# EAGLE design RH037.2 (EAGLE 7.1.0)
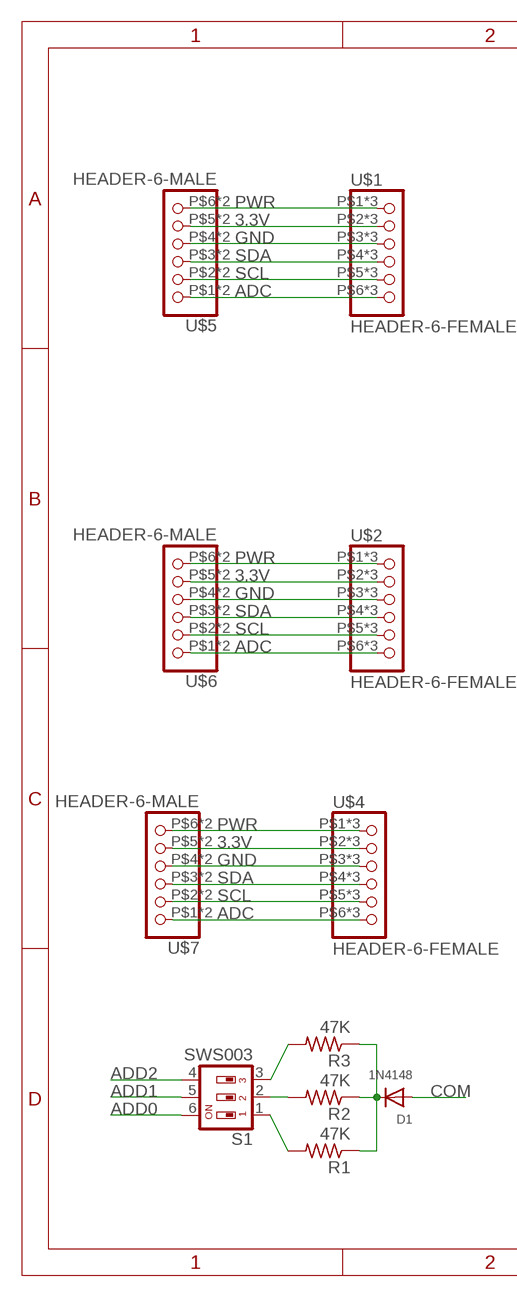
[diagram p0: schematic, sheet 1, part 1 of 2]
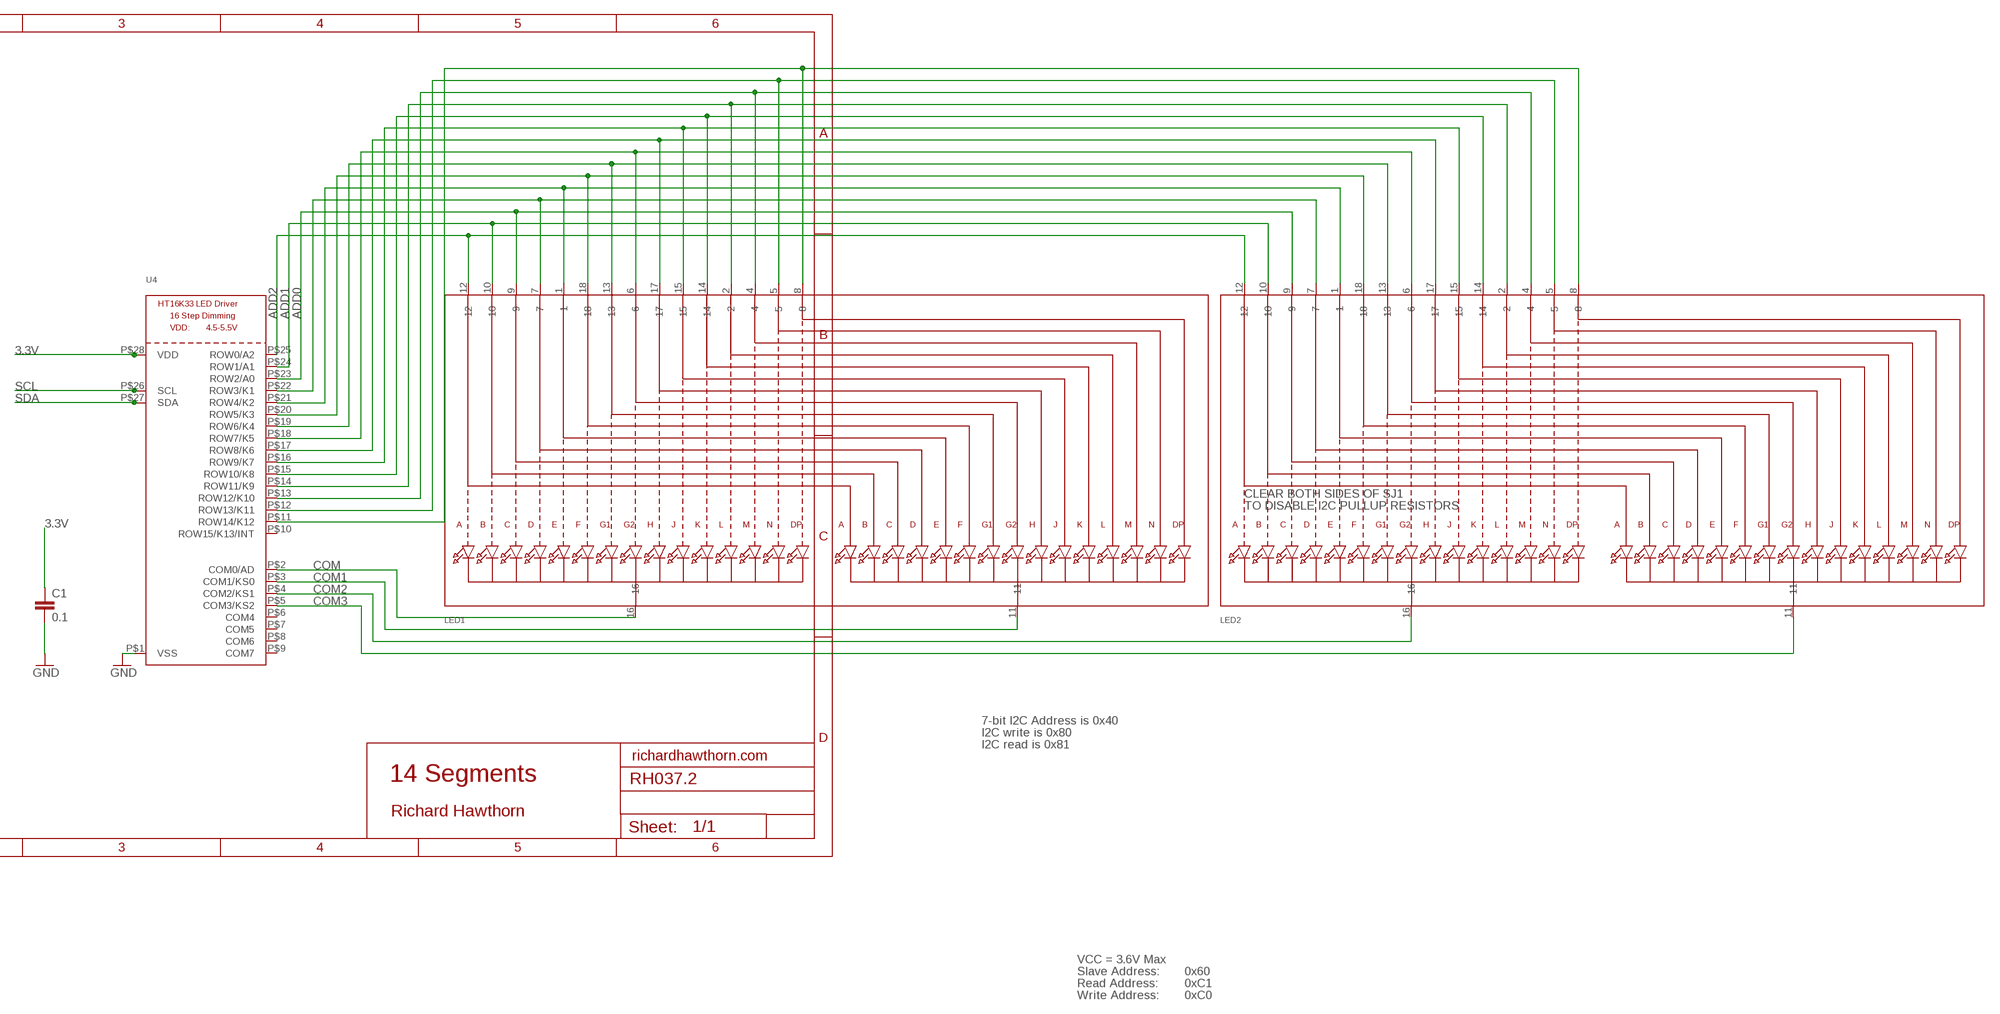
[diagram p1: schematic, sheet 1, part 2 of 2]

## Parts
C1  0.1  CAP0603-CAP  [0603-CAP]
D1  1N4148  DIODESOD-323F  [SOD-323F]
LED1  DISP_SEGMENT_STARBURST_DUAL_COMMONCATHODE  [SEGMENT_STARTBUST_DUAL_KWA-541CBB]
LED2  DISP_SEGMENT_STARBURST_DUAL_COMMONCATHODE  [SEGMENT_STARTBUST_DUAL_KWA-541CBB]
R1  47K  R-US_R0805  [R0805]
R2  47K  R-US_R0805  [R0805]
R3  47K  R-US_R0805  [R0805]
S1  SWS003  [SMS-003]
U4  HT16K33_SOP28  [SOP28_300MIL]
U$1  HEADER-6-FEMALE  [2MMHEADER6]
U$2  HEADER-6-FEMALE  [2MMHEADER6]
U$4  HEADER-6-FEMALE  [2MMHEADER6]
U$5  HEADER-6-MALE  [2MMHEADERPIN6]
U$6  HEADER-6-MALE  [2MMHEADERPIN6]
U$7  HEADER-6-MALE  [2MMHEADERPIN6]

## Nets
3.3V: C1.1 U4.P$28(VDD) U$1.P$2 U$1.P$10 U$1.P$18 U$2.P$2 U$2.P$10 U$2.P$18 U$4.P$2 U$4.P$10 U$4.P$18 U$5.P$5 U$5.P$13 U$6.P$5 U$6.P$13 U$7.P$5 U$7.P$13
ADC: U$1.P$6 U$1.P$14 U$1.P$22 U$2.P$6 U$2.P$14 U$2.P$22 U$4.P$6 U$4.P$14 U$4.P$22 U$5.P$1 U$5.P$9 U$6.P$1 U$6.P$9 U$7.P$1 U$7.P$9
ADD0: LED1.9 LED2.9 S1.6 U4.P$23(ROW2/A0)
ADD1: LED1.10 LED2.10 S1.5 U4.P$24(ROW1/A1)
ADD2: LED1.12 LED2.12 S1.4 U4.P$25(ROW0/A2)
COM: D1.A LED1.16 U4.P$2(COM0/AD)
COM1: LED1.11 U4.P$3(COM1/KS0)
COM2: LED2.16 U4.P$4(COM2/KS1)
COM3: LED2.11 U4.P$5(COM3/KS2)
GND [power]: C1.2 U4.P$1(VSS) U$1.P$3 U$1.P$11 U$1.P$19 U$2.P$3 U$2.P$11 U$2.P$19 U$4.P$3 U$4.P$11 U$4.P$19 U$5.P$4 U$5.P$12 U$6.P$4 U$6.P$12 U$7.P$4 U$7.P$12
N$5: R3.2 S1.3
N$17: D1.C R1.1 R2.1 R3.1
N$18: R1.2 S1.1
N$19: R2.2 S1.2
N$22: LED1.7 LED2.7 U4.P$22(ROW3/K1)
N$23: LED1.1 LED2.1 U4.P$21(ROW4/K2)
N$24: LED1.18 LED2.18 U4.P$20(ROW5/K3)
N$25: LED1.13 LED2.13 U4.P$19(ROW6/K4)
N$26: LED1.6 LED2.6 U4.P$18(ROW7/K5)
N$29: LED1.17 LED2.17 U4.P$17(ROW8/K6)
N$30: LED1.15 LED2.15 U4.P$16(ROW9/K7)
N$31: LED1.14 LED2.14 U4.P$15(ROW10/K8)
N$32: LED1.2 LED2.2 U4.P$14(ROW11/K9)
N$33: LED1.4 LED2.4 U4.P$13(ROW12/K10)
N$34: LED1.5 LED2.5 U4.P$12(ROW13/K11)
N$35: LED1.8 LED2.8 U4.P$11(ROW14/K12)
PWR [power]: U$1.P$1 U$1.P$9 U$1.P$17 U$2.P$1 U$2.P$9 U$2.P$17 U$4.P$1 U$4.P$9 U$4.P$17 U$5.P$6 U$5.P$14 U$6.P$6 U$6.P$14 U$7.P$6 U$7.P$14
SCL: U4.P$26(SCL) U$1.P$5 U$1.P$13 U$1.P$21 U$2.P$5 U$2.P$13 U$2.P$21 U$4.P$5 U$4.P$13 U$4.P$21 U$5.P$2 U$5.P$10 U$6.P$2 U$6.P$10 U$7.P$2 U$7.P$10
SDA: U4.P$27(SDA) U$1.P$4 U$1.P$12 U$1.P$20 U$2.P$4 U$2.P$12 U$2.P$20 U$4.P$4 U$4.P$12 U$4.P$20 U$5.P$3 U$5.P$11 U$6.P$3 U$6.P$11 U$7.P$3 U$7.P$11
Unconnected: U4.P$6(COM4) U4.P$7(COM5) U4.P$8(COM6) U4.P$9(COM7) U4.P$10(ROW15/K13/INT)

## Notes on the sheet
- CLEAR BOTH SIDES OF SJ1
- TO DISABLE I2C PULLUP RESISTORS
- 7-bit I2C Address is 0x40
- I2C write is 0x80
- I2C read is 0x81
- richardhawthorn.com
- 14 Segments
- Richard Hawthorn
- VCC = 3.6V Max
- Slave Address: | 0x60
- Read Address: | 0xC1
- Write Address: | 0xC0

## Library data of the parts
C1 = LowPowerLab:CAP: Capacitor Standard 0603 ceramic capacitor, and 0.1" leaded capacitor.
D1 = adafruit:DIODE: Diode SMADIODE - SMA Surface Mount Package 20V 1A Schottky Diode Digikey: 641-1014-6-ND DO-1N4148 - Through Hole Small Current Diode SOD-123 20V 1 A (.5mV Vf) Schottky Diode - Digikey: MBRX120TPMSCT-ND SOD-323 10V 570mA (.38mV Vf, 3ns) Schottky Diode - Digikey: ZLLS410CT-ND SOD-523 30V 30mA Schottky Diode (RB751S-40TE61) - Digikey: RB751S-40TE61CT-ND SOT23-R/W - SOT23 Package (R = Solder Paste/Reflow Ovens, W = Hand-Soldering) BAT54Film 40V 300mA - Digikey: 497-7162-1-ND
LED1 LED2 = microbuilder:DISP_SEGMENT_STARBURST_DUAL_COMMONCATHODE: 2 x Starburst Segment Displays - Common Cathode Luckylight KWA-541CBB
R1-R3 = adafruit:R-US_: RESISTOR, American symbol
S1 = smd-special:SWS003: SMD Dip Switch 3 pol.
U4 = microbuilder:HT16K33_SOP28
U$1 U$2 U$4 = Richards:HEADER-6-FEMALE
U$5-U$7 = Richards:HEADER-6-MALE

## Net classes
1 power: width 0.381 mm, clearance 0.254 mm

## Board
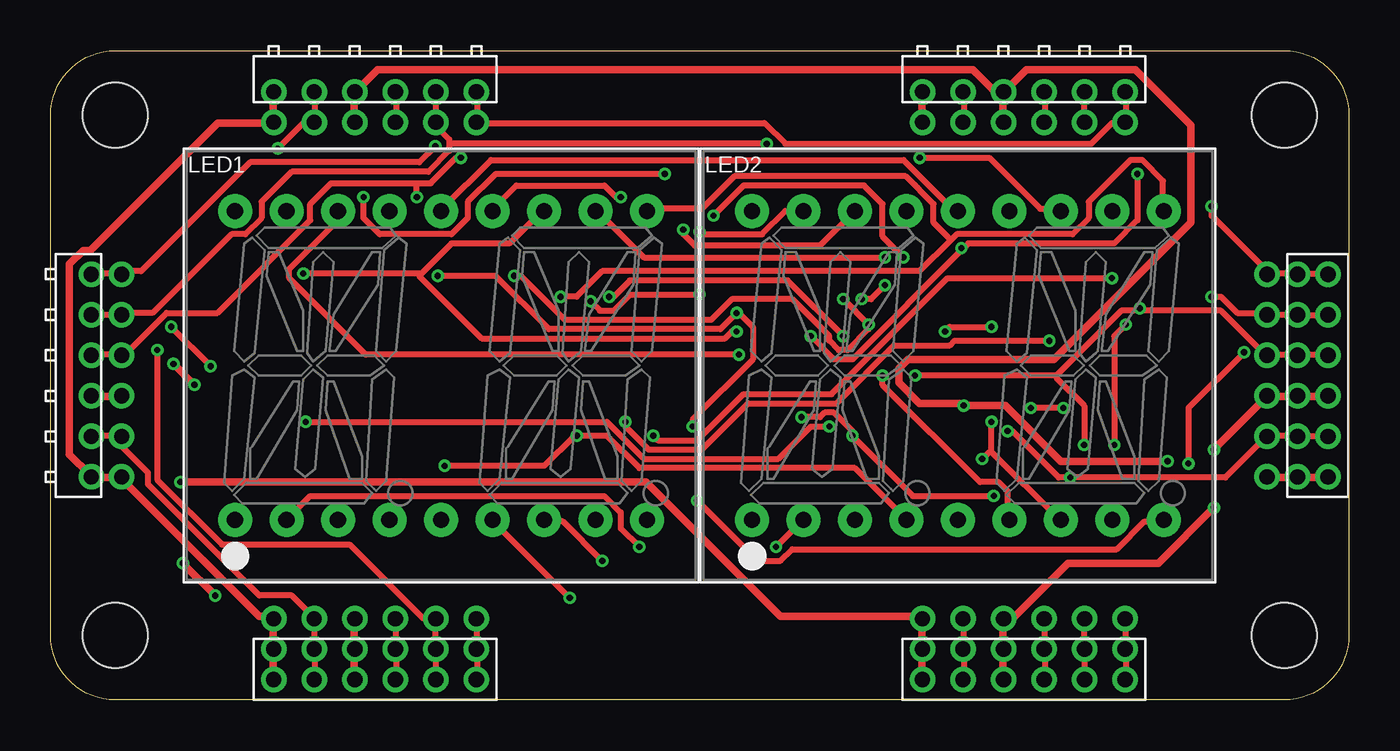
[diagram p2: board, top side]
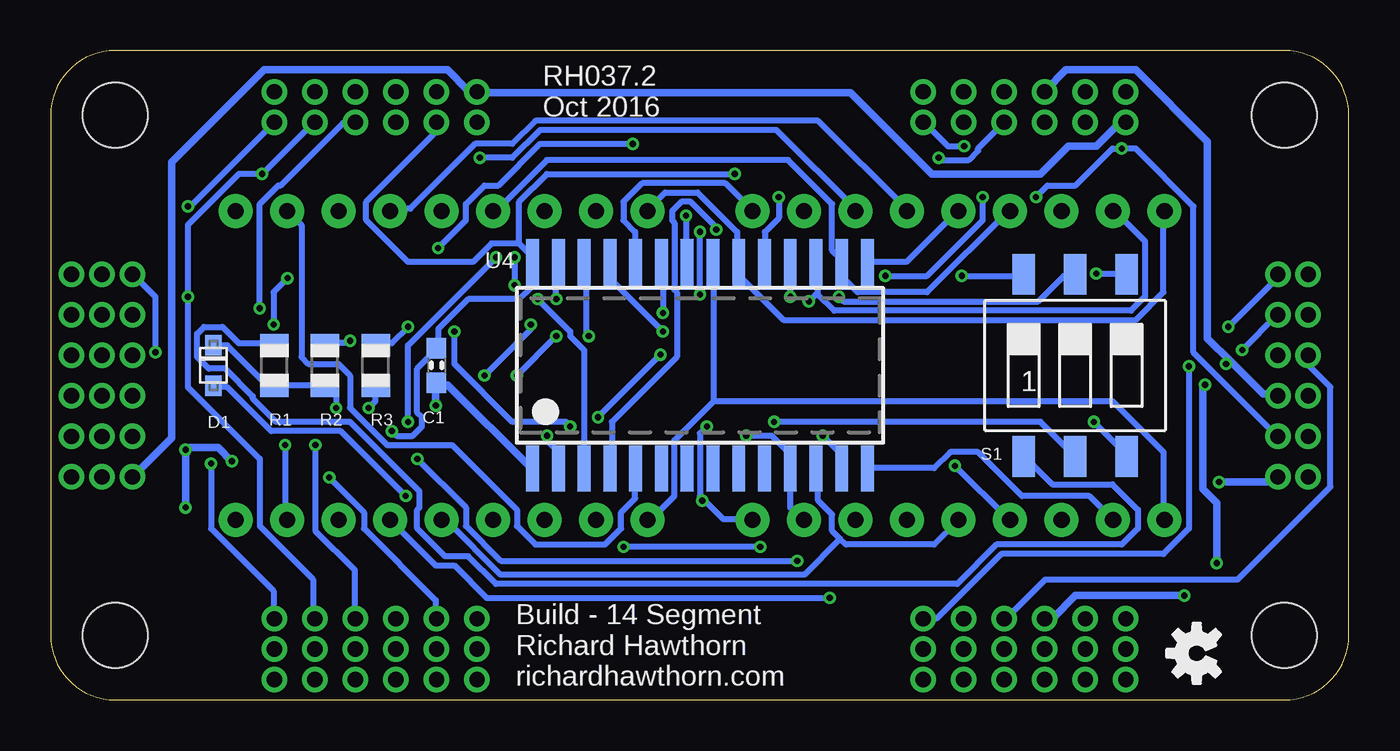
[diagram p3: board, bottom side, seen from below]

Size 64.03 x 32.03 mm. Coordinates in mm from the lower left corner, seen from the top.
Outline: 0,3.17 0,28.86 arc-90 3.17,32.03 60.85,32.03 arc-90 64.03,28.86 64.03,3.17 arc-90 60.85,0 3.17,0 arc-90 0,3.17
Copper layers (1*16): Top 0.035mm / dielectric 1.5mm / Bottom 0.035mm
Design rules "ITEADstudio_DRC *": minimum track width 12mil, minimum drill 12mil, track to track 6mil, track to pad 6mil, pad to pad 6mil, via to via 6mil, smd to smd 0mil, copper to edge 10mil, drill to drill 10mil, minimum pad ring 10mil, minimum via ring 6mil, stop-mask expansion 2mil, vias tented up to drill 100mil, thermal gap 15mil
Holes 3.2 mm at 3.17,3.17 60.85,3.17 3.17,28.86 60.85,28.86
tRestrict: area 0,0 to 5.7,5.7; area 58.3,26.3 to 64,32; area 0,26.3 to 5.7,32; area 58.3,0 to 64,5.7
bRestrict: area 58.3,0 to 64,5.7; area 0,26.3 to 5.7,32; area 58.3,26.3 to 64,32; area 0,0 to 5.7,5.7

### Footprints (pad centres in the part's own frame; a part is rotated, then mirrored left to right if it is on the bottom)
0603-CAP = smd 1.016 x 0.965: 1 -0.85,0; 2 0.85,0
SOD-323F = smd 1 x 0.8: A -1,0; C 1,0
SEGMENT_STARTBUST_DUAL_KWA-541CBB = drill 0.8 pad 1.676: 1 -10.16,-7.62; 2 -7.62,-7.62; 3 -5.08,-7.62; 4 -2.54,-7.62; 5 0,-7.62; 6 2.54,-7.62; 7 5.08,-7.62; 8 7.62,-7.62; 9 10.16,-7.62; 10 10.16,7.62; 11 7.62,7.62; 12 5.08,7.62; 13 2.54,7.62; 14 0,7.62; 15 -2.54,7.62; 16 -5.08,7.62; 17 -7.62,7.62; 18 -10.16,7.62
R0805 = smd 1.1 x 1.4: 1 -1,0; 2 1,0
SMS-003 = smd 1.092 x 2.007: 1 -2.54,-4.496; 2 0,-4.496; 3 2.54,-4.496; 4 2.54,4.496; 5 0,4.496; 6 -2.54,4.496
SOP28_300MIL = smd 0.635 x 2.286: P$1 -8.255,-5.08; P$2 -6.985,-5.08; P$3 -5.715,-5.08; P$4 -4.445,-5.08; P$5 -3.175,-5.08; P$6 -1.905,-5.08; P$7 -0.635,-5.08; P$8 0.635,-5.08; P$9 1.905,-5.08; P$10 3.175,-5.08; P$11 4.445,-5.08; P$12 5.715,-5.08; P$13 6.985,-5.08; P$14 8.255,-5.08; P$15 8.255,5.08; P$16 6.985,5.08; P$17 5.715,5.08; P$18 4.445,5.08; P$19 3.175,5.08; P$20 1.905,5.08; P$21 0.635,5.08; P$22 -0.635,5.08; P$23 -1.905,5.08; P$24 -3.175,5.08; P$25 -4.445,5.08; P$26 -5.715,5.08; P$27 -6.985,5.08; P$28 -8.255,5.08
2MMHEADER6 = drill 0.75: P$1 1,5; P$2 1,3; P$3 1,1; P$4 1,-1; P$5 1,-3; P$6 1,-5; P$9 -0.5,5; P$10 -0.5,3; P$11 -0.5,1; P$12 -0.5,-1; P$13 -0.5,-3; P$14 -0.5,-5; P$17 -2,5; P$18 -2,3; P$19 -2,1; P$20 -2,-1; P$21 -2,-3; P$22 -2,-5
2MMHEADERPIN6 = drill 0.75: P$1 1,5; P$2 1,3; P$3 1,1; P$4 1,-1; P$5 1,-3; P$6 1,-5; P$9 -0.5,5; P$10 -0.5,3; P$11 -0.5,1; P$12 -0.5,-1; P$13 -0.5,-3; P$14 -0.5,-5

### Placement (x,y rotation side)
C1  45,16.5 270 bottom
D1  56,16.5 90 bottom
LED1  19.25,16.5 0 top
LED2  44.75,16.5 0 top
R1  53,16.5 90 bottom
R2  50.5,16.5 90 bottom
R3  48,16.5 90 bottom
S1  13.5,16.5 0 bottom
U4  32,16.5 0 bottom
U$1  16,3 90 top
U$2  48,3 90 top
U$3  [OSHW-LOGO-S]  7.5,2.3 90 bottom
U$4  61,16 180 top
U$5  48,29.5 270 top
U$6  16,29.5 270 top
U$7  2.5,16 0 top

### Tracks (layer width: path | path; a pad name or v marks a point on that pad's centre or on a via)
3.3V  (via drill 0.3)
  Top 0.305: U$6.P$13 13.03,29.95 13.03,28.57 U$6.P$5 12.92,28.46 12.46,28.46 v11.2,27.2 | U$7.P$13 2.06,13.03 3.43,13.03 U$7.P$5 3.54,12.92 3.54,12.46 4.8,11.2 4.8,10.63 10.29,5.14 11.89,5.14 12.92,4.12 U$1.P$2 13.03,3.89 13.03,2.63 U$1.P$10 13.03,2.4 13.03,1.03 U$1.P$18 | U$5.P$5 45.03,28.57 45.03,29.95 U$5.P$13 | U$2.P$18 45.03,1.03 45.03,2.4 U$2.P$10 45.03,2.63 45.03,3.89 U$2.P$2 | U$4.P$18 62.98,13.03 61.61,13.03 U$4.P$10 61.49,13.03 60.01,13.03 U$4.P$2 59.89,12.92 57.95,10.97 v50.29,10.97 49.72,10.97 47.43,13.26 v47.21,13.26 | v15.43,24.8 15.43,23.77 16.23,22.97 19.77,22.97 20.57,23.77 20.57,24.57 21.95,25.95 v30.29,25.95
  Bottom 0.305: U$7.P$5 3.54,13.03 7.66,17.14 7.66,24.35 10.52,27.2 v11.2,27.2 11.66,27.2 13.49,25.38 14.86,25.38 v15.43,24.8 | 40.92,22.52 42.29,22.52 43.2,21.6 46.41,21.6 48.46,23.66 48.46,24.57 45.03,28 45.03,28.46 U$5.P$5 | 40.92,22.52 40.23,21.83 40.23,21.72 U4.P$28 40.35,21.49 40.35,20.34 40.92,19.77 43.43,19.77 44.92,18.29 44.92,17.37 C1.1 45.03,17.26 45.95,16.34 45.95,14.17 45.72,13.95 45.72,13.49 46.18,13.03 46.98,13.03 v47.21,13.26 | v50.29,10.97 48.58,9.26 48.58,8.46 45.03,4.92 45.03,4 U$2.P$2 | v30.29,25.95 39.55,25.95 40.92,24.57 40.92,22.52
ADC  (via drill 0.3)
  Top 0.305: U$2.P$22 53.03,1.03 53.03,2.4 U$2.P$14 53.03,2.63 53.03,3.89 U$2.P$6 | U$5.P$9 53.03,29.95 53.03,28.57 U$5.P$1 52.92,28.46 52.35,28.46 51.32,27.43 36.23,27.43 35.2,28.46 21.14,28.46 U$6.P$1 21.03,28.57 21.03,29.95 U$6.P$9 | U$4.P$22 62.98,21.03 61.61,21.03 U$4.P$14 61.49,21.03 60.01,21.03 U$4.P$6 60.01,21.14 57.26,23.89 v57.26,24.35 | v56.12,11.66 56.12,14.4 v58.86,17.14 | U$1.P$22 21.03,1.03 21.03,2.4 U$1.P$14 21.03,2.63 21.03,3.89 U$1.P$6 | U$7.P$9 2.06,21.03 3.43,21.03 U$7.P$1 3.54,21.14 4.46,21.14 9.83,26.52 18.17,26.52 v18.97,27.32 | v5.94,18.4 v7.89,16.46
  Bottom 0.305: v57.26,24.35 57.15,24.35 53.03,28.46 U$5.P$1 | v56.12,11.66 56.12,8.46 53.03,5.37 53.03,4 U$2.P$6 | v58.86,17.14 58.86,19.89 59.89,20.92 U$4.P$6 | v18.97,27.32 19.77,27.32 20.92,28.46 U$6.P$1 | v7.89,16.46 7.89,8.46 9.14,7.2 17.14,7.2 20.34,4 20.92,4 U$1.P$6 | v5.94,18.4 3.43,20.92 U$7.P$1
ADD0  (via drill 0.3)
  Top 0.305: v19.09,20.92 21.95,20.92 24.57,18.29 33.03,18.29 v33.83,19.09 33.95,19.09 34.63,18.4 34.63,16.8 31.66,13.83 v31.66,13.49 | v31.89,9.83 34.86,6.86 36.01,6.86 36.58,7.43 52.58,7.43 53.95,8.8 54.86,8.8 LED2.9
  Bottom 0.305: v19.09,20.92 16.12,20.92 S1.6 | v33.83,19.09 33.83,21.49 U4.P$23 | 31.83,9.89 32,10.06 32,13.14 v31.66,13.49 | 31.83,9.89 30.86,8.91 29.49,8.91 LED1.9 | v31.89,9.83 31.83,9.89
ADD1  (via drill 0.3)
  Top 0.305: v25.15,19.89 25.95,19.89 27.2,21.14 42.86,21.14 44.41,22.69 | 44.41,22.69 44.69,22.97 50.41,22.97 51.21,23.77 51.21,24.57 53.26,26.63 53.84,26.63 54.86,25.6 54.86,24.23 LED2.10 | 44.41,22.69 43.55,23.55 43.55,24.46 42.18,25.83 33.72,25.83 32.12,24.23 29.49,24.23 LED1.10
  Bottom 0.305: U4.P$24 35.2,21.6 35.2,23.09 35.78,23.66 35.78,24.57 34.86,25.49 30.75,25.49 29.49,24.23 LED1.10 | v25.15,19.89 24.92,19.66 15.32,19.66 14.06,20.92 13.6,20.92 S1.5
ADD2  (via drill 0.3)
  Top 0.305: 18.17,21.03 18.29,21.03 19.77,22.52 22.63,22.52 24.23,24.12 LED1.12 | 18.17,21.03 v12.46,21.03 | v33.83,18.17 33.6,18.17 33.26,17.83 21.26,17.83 18.17,20.92 18.17,21.03 | v42.86,26.75 46.29,26.75 48.81,24.23 49.72,24.23 LED2.12
  Bottom 0.305: v12.46,21.03 10.97,21.03 S1.4 | v33.83,18.17 36.35,20.69 36.35,21.49 U4.P$25 | v42.86,26.75 41.26,26.75 39.89,28.12 28.23,28.12 24.35,24.23 LED1.12
COM  (via drill 0.3)
  Top 0.305: v46.52,10.06 42.52,10.06 v39.55,13.03 39.55,13.26 38.63,14.17 38.18,14.17 37.95,13.95 v37.03,13.95 | v33.95,17.03 15.54,17.03 11.77,20.8 11.77,21.26 14.06,23.55 14.06,24.12 LED1.16
  Bottom 0.305: v46.52,10.06 49.72,13.26 53.15,13.26 55.32,15.43 55.89,15.43 D1.A | v39.55,13.03 39.55,12.8 39.09,12.34 39.09,11.43 U4.P$2 | v37.03,13.95 v33.95,17.03
COM1  (via drill 0.3)
  Top 0.305: v40.01,19.77 40.46,19.77 v41.15,20.46 | v41.15,21.83 29.26,21.83 26.98,24.12 LED1.11
  Bottom 0.305: v40.01,19.77 38.41,18.17 38.41,17.95 37.72,17.26 U4.P$3 | v41.15,21.83 v41.15,20.46
COM2  (via drill 0.3)
  Top 0.305: v31.2,23.2 31.2,22.97 31.77,22.4 37.95,22.4 LED2.16
  Bottom 0.305: v31.2,23.2 31.2,23.32 32.46,24.57 32.92,24.57 33.38,24.12 33.38,23.66 33.26,23.55 33.26,20.23 33.15,20.12 33.15,16.92 36.35,13.72 36.35,11.43 U4.P$4
COM3
  Bottom 0.305: U4.P$5 35.2,11.32 35.2,9.94 35.89,9.26 35.89,8.46 36.69,7.66 40.12,7.66 41.03,8.57 41.03,9.37 44.23,12.57 47.43,12.57 49.26,14.4 49.26,16 49.84,16.57 51.32,16.57 51.66,16.92 51.66,23.43 52.35,24.12 LED2.11
GND  (via drill 0.3)
  Top 0.381: U$2.P$19 46.98,1.03 46.98,2.4 U$2.P$11 46.98,2.63 46.98,3.89 U$2.P$3 47.09,4.12 47.55,4.12 50.18,6.74 54.63,6.74 v57.38,9.49 | U$4.P$19 62.98,14.97 61.61,14.97 U$4.P$11 61.49,14.97 60.01,14.97 U$4.P$3 59.89,14.86 v57.38,12.34 | v55.09,11.77 49.84,11.77 47.09,14.52 v45.03,14.52 44.92,14.63 42.86,14.63 41.83,15.66 41.83,16.34 42.29,16.8 49.49,16.8 56.24,23.55 56.24,28.35 53.49,31.09 48.12,31.09 47.09,30.06 U$5.P$12 | U$1.P$19 14.97,1.03 14.97,2.4 U$1.P$11 14.97,2.63 14.97,3.89 U$1.P$3 | U$5.P$4 46.98,28.57 46.98,29.95 U$5.P$12 | U$7.P$12 2.06,14.97 3.43,14.97 U$7.P$4 | U$6.P$4 14.97,28.57 14.97,29.95 U$6.P$12 15.09,30.06 16.12,31.09 45.49,31.09 46.52,30.06 46.86,30.06 U$5.P$12 | v6.51,6.74 v8.12,5.14 | v6.06,16.57 v7.09,15.54
  Bottom 0.381: U4.P$1 40.35,11.43 44.46,15.54 44.92,15.54 C1.2 45.03,15.43 v45.03,14.52 | v57.38,9.49 v57.38,12.34 57.26,12.46 55.78,12.46 v55.09,11.77 | 5.83,16.69 6.97,17.83 6.97,27.55 10.52,31.09 13.95,31.09 14.97,30.06 U$6.P$12 | 5.83,16.69 4.23,15.09 3.54,15.09 U$7.P$4 | v8.12,5.14 13.49,5.14 14.63,4 14.97,4 U$1.P$3 | v6.51,6.74 6.51,9.72 7.2,10.4 7.2,15.43 v7.09,15.54 | v6.06,16.57 5.94,16.57 5.83,16.69
N$5  (via drill 0.3)
  Top 0.305: v46.41,18.4 44.35,18.4 v44.12,18.17 | v38.41,13.49 37.49,13.49 35.89,11.89 29.26,11.89 27.43,13.72 v12.57,13.72
  Bottom 0.305: v46.41,18.4 47.21,17.6 47.89,17.6 R3.2 | v44.12,18.17 44.12,16.57 41.26,13.72 38.63,13.72 v38.41,13.49 | v12.57,13.72 10.97,12.12 S1.3
N$17  (via drill 0.3)
  Top 0.305: v49.95,14.4 v48.35,14.4
  Bottom 0.305: v48.35,14.4 48.01,14.74 48.01,15.43 R3.1 | v49.95,14.4 49.95,14.97 50.41,15.43 R2.1 50.63,15.54 52.92,15.54 R1.1 53.03,15.54 53.38,15.54 55.32,17.49 55.89,17.49 D1.C
N$18
  Bottom 0.305: R1.2 53.03,17.6 54.75,17.6 55.55,18.4 56.46,18.4 56.81,18.06 56.81,16.92 56.24,16.34 55.44,16.34 54.06,14.97 54.06,14.86 52.92,13.72 49.26,13.72 45.83,10.29 45.83,9.49 45.95,9.37 45.95,8.46 44.58,7.09 43.43,7.09 42.06,5.71 19.32,5.71 17.37,7.66 11.2,7.66 10.4,8.46 10.4,9.37 11.66,10.63 14.63,10.63 16,12 S1.1
N$19  (via drill 0.3)
  Top 0.305: v49.26,17.72 44.58,17.72 44.35,17.49 41.6,17.49 38.75,14.63 34.4,14.63 32.12,12.34 29.49,12.34 28.35,13.49 v28.35,13.72
  Bottom 0.305: v49.26,17.72 49.38,17.6 50.41,17.6 R2.2 | v28.35,13.72 15.2,13.72 13.6,12.12 S1.2
N$22  (via drill 0.3)
  Top 0.305: v32.69,23.89 34.18,25.38 40.12,25.38 41.03,24.46 41.03,22.86 v42.06,21.83 | 46.41,12.23 v46.41,13.72 | 46.41,12.23 49.72,8.91 LED2.7 | v27.2,6.86 25.26,8.8 24.35,8.8 LED1.7 | v45.95,11.89 46.29,12.23 46.41,12.23
  Bottom 0.305: v32.69,23.89 32.69,21.6 U4.P$22 | v42.06,21.83 46.41,17.49 v46.41,13.72 | v27.2,6.86 41.83,6.86 43.55,8.57 43.55,9.49 v45.95,11.89
N$23
  Bottom 0.305: 31.32,14.74 31.32,21.49 U4.P$21 | 31.32,14.74 33.26,12.8 33.26,10.06 34.52,8.8 LED2.1 | 31.32,14.74 11.66,14.74 9.14,12.23 9.14,8.91 LED1.1
N$24
  Bottom 0.305: LED2.18 34.52,24.23 33.72,25.03 32.12,25.03 30.18,23.09 30.18,21.6 U4.P$20 30.06,21.49 30.06,20.92 27.89,18.75 10.52,18.75 9.14,20.12 9.14,24.12 LED1.18
N$25  (via drill 0.3)
  Top 0.305: v28.12,24.8 27.89,24.8 27.32,25.38 22.97,25.38 21.83,24.23 LED1.13
  Bottom 0.305: v28.12,24.8 28.12,23.77 28.8,23.09 28.8,21.6 U4.P$19 | LED2.13 47.21,24.23 46.29,24.23 43.09,27.43 41.26,27.43 40.12,28.57 26.18,28.57 21.83,24.23 LED1.13
N$26  (via drill 0.3)
  Top 0.305: v27.55,19.89 27.77,19.89 28.57,20.69 36.35,20.69 v39.09,17.95 | v41.03,16 41.03,15.54 45.83,10.74 46.75,10.74 47.21,10.29 47.21,8.91 LED2.6 | v25.6,5.03 21.83,8.8 LED1.6
  Bottom 0.305: v27.55,19.89 27.55,21.49 U4.P$18 | v41.03,16 v39.09,17.95 | v25.6,5.03 42.52,5.03 44.12,6.63 45.03,6.63 47.21,8.8 LED2.6
N$29  (via drill 0.3)
  Top 0.305: v32,23.09 32.12,22.97 35.09,22.97 36.23,24.12 37.03,24.12 LED2.17 | v32,20 28.57,20 27.77,19.2 27.09,19.2 v26.63,19.66
  Bottom 0.305: 26.18,20 26.18,21.49 U4.P$17 | 26.18,20 25.38,19.2 10.74,19.2 10.06,19.89 10.06,22.63 11.54,24.12 LED1.17 | v32,20 v32,23.09 | v26.63,19.66 26.29,20 26.18,20
N$30
  Bottom 0.305: LED1.15 16.8,24.12 20.8,20.12 24.23,20.12 24.92,20.8 24.92,21.49 U4.P$16 25.03,21.72 25.49,22.17 25.49,24.46 27.66,26.63 39.55,26.63 41.95,24.23 42.18,24.23 LED2.15
N$31
  Top 0.305: LED2.14 44.69,24.23 44.46,24.23 42.06,26.63 21.72,26.63 19.32,24.23 LED1.14
  Bottom 0.305: U4.P$15 23.66,21.6 21.83,21.6 19.32,24.12 LED1.14
N$32  (via drill 0.3)
  Top 0.305: v35.78,7.54 37.03,8.8 LED2.2 | v29.03,7.54 28.12,8.46 28.12,9.26 27.32,10.06 12.8,10.06 11.66,8.91 LED1.2
  Bottom 0.305: U4.P$14 23.66,11.43 20.46,11.43 19.66,12.23 18.29,12.23 16.12,10.06 12.8,10.06 11.66,8.91 LED1.2 | v29.03,7.54 v35.78,7.54
N$33  (via drill 0.3)
  Top 0.305: LED2.4 42.18,8.91 39.66,11.43 29.03,11.43 27.43,13.03 v25.95,13.03 25.83,13.03 24.35,11.54 v19.43,11.54
  Bottom 0.305: v25.95,13.03 25.03,12.12 25.03,11.43 U4.P$13 | v19.43,11.54 16.8,8.91 LED1.4
N$34
  Bottom 0.305: 25.09,7.94 24.8,7.66 20.46,7.66 19.32,8.8 LED1.5 | 25.09,7.94 25.49,8.34 25.49,9.14 26.18,9.83 26.18,11.32 U4.P$12 | 25.09,7.94 26.86,6.17 41.83,6.17 44.46,8.8 44.69,8.8 LED2.5
N$35  (via drill 0.3)
  Top 0.305: v52.46,12.57 52.46,17.95 v53.03,18.52 | v52.35,20.8 44.23,20.8 38.52,15.09 34.18,15.09 31.89,12.8 29.95,12.8 v29.72,13.03
  Bottom 0.305: LED1.8 26.98,8.91 27.55,9.49 27.55,11.32 U4.P$11 27.55,11.54 27.55,12.12 28.46,13.03 v29.72,13.03 | v52.46,12.57 52.46,8.91 LED2.8 | v53.03,18.52 53.03,20.12 v52.35,20.8
PWR  (via drill 0.3)
  Top 0.381: U$5.P$6 42.98,28.57 42.98,29.95 U$5.P$14 | U$4.P$1 60.01,10.97 61.49,10.97 U$4.P$9 61.61,10.97 62.98,10.97 U$4.P$17 | U$2.P$17 42.98,1.03 42.98,2.4 U$2.P$9 42.98,2.63 42.98,3.89 U$2.P$1 42.86,4.12 36.01,4.12 29.38,10.74 v6.4,10.74 | U$6.P$14 10.97,29.95 10.97,28.57 U$6.P$6 10.86,28.46 8.23,28.46 1.94,22.17 1.6,22.17 0.91,21.49 0.91,12.12 1.94,11.09 U$7.P$14 2.06,10.97 3.43,10.97 U$7.P$6 3.54,10.86 10.29,4.12 10.86,4.12 U$1.P$1 10.97,3.89 10.97,2.63 U$1.P$9 10.97,2.4 10.97,1.03 U$1.P$17
  Bottom 0.381: U$4.P$1 59.89,11.09 58.06,12.92 58.06,26.52 53.49,31.09 44.46,31.09 43.43,30.06 43.09,30.06 U$5.P$14 42.86,29.95 24.57,29.95 20.57,25.95 15.2,25.95 13.83,27.32 12.46,27.32 11.32,28.46 11.09,28.46 U$6.P$6 | v6.4,10.74 3.77,10.74 3.54,10.97 U$7.P$6
SCL  (via drill 0.3)
  Top 0.305: U$1.P$21 18.97,1.03 18.97,2.4 U$1.P$13 18.97,2.63 18.97,3.89 U$1.P$5 18.86,4 18.4,4 14.74,7.66 8.46,7.66 5.26,10.86 v5.26,17.26 | U$7.P$10 2.06,18.97 3.43,18.97 U$7.P$2 3.54,19.09 5.03,19.09 8.91,22.97 9.6,22.97 10.4,23.77 10.4,24.57 11.89,26.06 18.63,26.06 19.66,27.09 19.66,27.43 | U$6.P$10 18.97,29.95 18.97,28.57 U$6.P$2 18.97,28.35 19.66,27.66 19.66,27.43 | U$4.P$21 62.98,18.97 61.61,18.97 U$4.P$13 61.49,18.97 60.01,18.97 U$4.P$5 59.89,19.09 58.52,19.09 57.72,19.89 v57.26,19.89 | U$2.P$21 50.98,1.03 50.98,2.4 U$2.P$13 50.98,2.63 50.98,3.89 U$2.P$5 | v37.49,17.95 38.63,16.8 39.55,16.8 44.98,22.23 | 44.98,22.23 45.26,22.52 52.46,22.52 53.61,23.66 v53.61,25.95 | U$5.P$10 50.98,29.95 50.98,28.57 U$5.P$2 | v35.32,27.43 19.66,27.43 | v44.92,22.29 44.98,22.23
  Bottom 0.305: v5.26,17.26 3.54,18.97 U$7.P$2 | v37.49,17.95 37.6,18.06 37.6,21.49 U4.P$26 | U$5.P$2 51.09,28.46 v53.61,25.95 54.75,25.95 57.26,23.43 v57.26,19.89 57.26,15.43 53.72,11.89 53.72,8.57 51.09,5.94 51.09,4 U$2.P$5 | v35.32,27.43 39.89,27.43 41.95,25.38 42.63,25.38 43.55,24.46 43.55,23.66 v44.92,22.29
SDA  (via drill 0.3)
  Top 0.305: U$6.P$3 17.03,28.57 17.03,29.95 U$6.P$11 | U$7.P$11 2.06,17.03 3.43,17.03 U$7.P$3 3.54,16.92 5.71,19.09 8.23,19.09 12.8,23.66 12.8,24.46 13.83,25.49 18.06,25.49 | U$1.P$20 17.03,1.03 17.03,2.4 U$1.P$12 17.03,2.63 17.03,3.89 U$1.P$4 | v20.23,26.75 20,26.75 18.75,25.49 18.06,25.49 | U$2.P$20 49.03,1.03 49.03,2.4 U$2.P$12 49.03,2.63 49.03,3.89 U$2.P$4 | U$5.P$3 49.03,28.57 49.03,29.95 U$5.P$11 | v39.09,19.77 v40.35,18.52 40.35,18.29 39.32,17.26 38.86,17.26 38.41,17.72 38.41,17.95 36.58,19.77 33.6,19.77 32.58,18.75 25.38,18.75 23.2,20.92 v22.86,20.92 | 49.61,16 v42.63,16 | 49.61,16 52.81,19.2 53.72,19.2 | 53.72,19.2 57.72,19.2 59.89,17.03 U$4.P$4 60.12,17.03 61.49,17.03 U$4.P$12 61.61,17.03 62.98,17.03 U$4.P$20 | v53.72,19.32 53.72,19.2 | v50.98,12.57 50.98,14.52 49.61,15.89 49.61,16 | v18.06,24.8 18.06,25.49
  Bottom 0.305: U$7.P$11 1.94,16.92 1.94,16.46 0.91,15.43 0.91,10.52 5.49,5.94 14.97,5.94 16.92,4 U$1.P$4 | v20.23,26.75 20.12,26.63 18.75,26.63 18.29,27.09 18.29,27.2 17.03,28.46 U$6.P$3 | v39.09,19.77 39.09,21.49 U4.P$27 | v40.35,18.52 40.35,18.29 v42.63,16 | v53.72,19.32 53.72,24.46 52.81,25.38 52.69,25.38 49.61,28.46 49.03,28.46 U$5.P$3 | v50.98,12.57 50.98,8.34 49.03,6.4 49.03,4 U$2.P$4 | v18.06,24.8 18.06,23.66 20.8,20.92 v22.86,20.92

### Text on the board
bPlace: RH037.2 / Oct 2016 | Build - 14 Segment / Richard Hawthorn / richardhawthorn.com
tDocu: REG